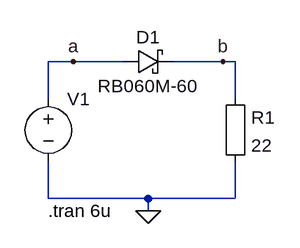
[diagram p0: schematic TRR-9.asc]
TRR-9.asc, the LTspice schematic file:
Version 4
SHEET 1 880 680
WIRE -176 128 -208 128
WIRE -112 128 -176 128
WIRE 16 128 -48 128
WIRE 32 128 16 128
WIRE -208 176 -208 128
WIRE 32 176 32 128
WIRE -208 304 -208 256
WIRE -80 304 -208 304
WIRE 32 304 32 256
WIRE 32 304 -80 304
WIRE -80 320 -80 304
FLAG -80 320 0
FLAG -176 128 a
FLAG 16 128 b
SYMBOL schottky -112 144 R270
WINDOW 0 32 32 VTop 2
WINDOW 3 0 32 VBottom 2
SYMATTR InstName D1
SYMATTR Value RB060M-60
SYMATTR Description Diode
SYMATTR Type diode
SYMBOL Misc\\EuropeanResistor 16 160 R0
SYMATTR InstName R1
SYMATTR Value 22
SYMBOL voltage -208 160 R0
WINDOW 3 10 105 Invisible 2
WINDOW 123 0 0 Left 2
SYMATTR Value PULSE(60 -60 1u 5n 5n 9u 20u)
SYMATTR SpiceLine Rser=10
SYMATTR InstName V1
TEXT -208 320 Left 2 !.tran 6u

The netlist it stands for:
* TRR-9.asc
D1 a b RB060M-60
R1 b 0 22
V1 a 0 PULSE(60 -60 1u 5n 5n 9u 20u) Rser=10
.model D D
.lib standard.dio
.tran 6u
.backanno
.end